# Altium schematic sheet Multi2Meter.SchDoc
size A3
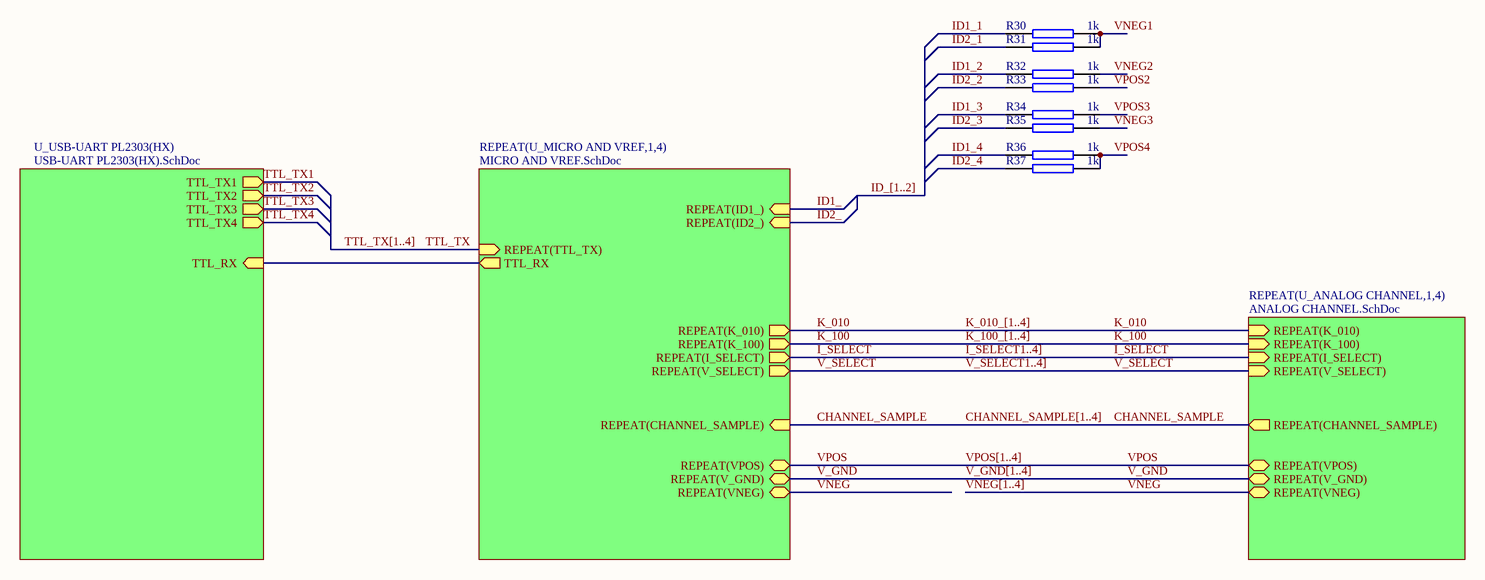
[diagram p0: Multi2Meter.SchDoc]

## Parts
R30  1k  [RES (3D) - 0603]
R31  1k  [RES (3D) - 0603]
R32  1k  [RES (3D) - 0603]
R33  1k  [RES (3D) - 0603]
R34  1k  [RES (3D) - 0603]
R35  1k  [RES (3D) - 0603]
R36  1k  [RES (3D) - 0603]
R37  1k  [RES (3D) - 0603]

## Sub-sheets
REPEAT(U_ANALOG CHANNEL,1,4) = ANALOG CHANNEL.SchDoc: REPEAT(K_010) (in), REPEAT(K_100) (in), REPEAT(I_SELECT) (in), REPEAT(V_SELECT) (in), REPEAT(CHANNEL_SAMPLE) (out), REPEAT(V_GND) (bidir), REPEAT(VPOS) (bidir), REPEAT(VNEG) (bidir)
REPEAT(U_MICRO AND VREF,1,4) = MICRO AND VREF.SchDoc: REPEAT(TTL_TX) (in), TTL_RX, REPEAT(K_010) (out), REPEAT(K_100) (out), REPEAT(I_SELECT) (out), REPEAT(V_SELECT) (out), REPEAT(CHANNEL_SAMPLE) (in), REPEAT(V_GND) (bidir), REPEAT(VPOS) (bidir), REPEAT(VNEG) (bidir), REPEAT(ID1_) (in), REPEAT(ID2_) (in)
U_USB-UART PL2303(HX) = USB-UART PL2303(HX).SchDoc: TTL_TX1 (out), TTL_TX2 (out), TTL_TX3 (out), TTL_TX4 (out), TTL_RX (in)

## Nets
CHANNEL_SAMPLE: sheet REPEAT(U_ANALOG CHANNEL,1,4)/REPEAT(CHANNEL_SAMPLE), sheet REPEAT(U_MICRO AND VREF,1,4)/REPEAT(CHANNEL_SAMPLE)
I_SELECT: sheet REPEAT(U_ANALOG CHANNEL,1,4)/REPEAT(I_SELECT), sheet REPEAT(U_MICRO AND VREF,1,4)/REPEAT(I_SELECT)
ID1_: sheet REPEAT(U_MICRO AND VREF,1,4)/REPEAT(ID1_)
ID1_1: R30.1
ID1_2: R32.1
ID1_3: R34.1
ID1_4: R36.1
ID2_: sheet REPEAT(U_MICRO AND VREF,1,4)/REPEAT(ID2_)
ID2_1: R31.1
ID2_2: R33.1
ID2_3: R35.1
ID2_4: R37.1
K_010: sheet REPEAT(U_ANALOG CHANNEL,1,4)/REPEAT(K_010), sheet REPEAT(U_MICRO AND VREF,1,4)/REPEAT(K_010)
K_100: sheet REPEAT(U_ANALOG CHANNEL,1,4)/REPEAT(K_100), sheet REPEAT(U_MICRO AND VREF,1,4)/REPEAT(K_100)
TTL_TX: sheet REPEAT(U_MICRO AND VREF,1,4)/REPEAT(TTL_TX)
TTL_TX1: sheet U_USB-UART PL2303(HX)/TTL_TX1
TTL_TX2: sheet U_USB-UART PL2303(HX)/TTL_TX2
TTL_TX3: sheet U_USB-UART PL2303(HX)/TTL_TX3
TTL_TX4: sheet U_USB-UART PL2303(HX)/TTL_TX4
V_GND: sheet REPEAT(U_ANALOG CHANNEL,1,4)/REPEAT(V_GND), sheet REPEAT(U_MICRO AND VREF,1,4)/REPEAT(V_GND)
V_SELECT: sheet REPEAT(U_ANALOG CHANNEL,1,4)/REPEAT(V_SELECT), sheet REPEAT(U_MICRO AND VREF,1,4)/REPEAT(V_SELECT)
VNEG: sheet REPEAT(U_ANALOG CHANNEL,1,4)/REPEAT(VNEG), sheet REPEAT(U_MICRO AND VREF,1,4)/REPEAT(VNEG)
VNEG1: R30.2 R31.2
VNEG2: R32.2
VNEG3: R35.2
VPOS: sheet REPEAT(U_ANALOG CHANNEL,1,4)/REPEAT(VPOS), sheet REPEAT(U_MICRO AND VREF,1,4)/REPEAT(VPOS)
VPOS2: R33.2
VPOS3: R34.2
VPOS4: R36.2 R37.2
(unnamed): sheet REPEAT(U_MICRO AND VREF,1,4)/TTL_RX, sheet U_USB-UART PL2303(HX)/TTL_RX

## Buses and harness runs
bus CHANNEL_SAMPLE[1..4]
bus I_SELECT1..4]
bus ID_[1..2]
bus K_010_[1..4]
bus K_100_[1..4]
bus TTL_TX[1..4]
bus V_GND[1..4]
bus V_SELECT1..4]
bus VNEG[1..4]
bus VPOS[1..4]

## Library data of the parts
R30-R37 = RES SMD 0603: RESISTOR SMD 0603; value: 1k